# EAGLE schematic PCB_Outline (EAGLE 6.5.0)
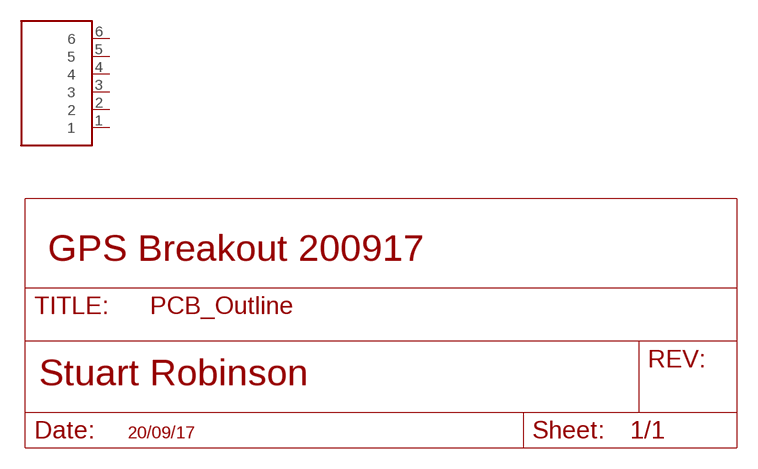
[diagram p0: schematic, sheet 1]

## Parts
CON1  6X1  [6X1]
Unconnected: CON1.1 CON1.2 CON1.3 CON1.4 CON1.5 CON1.6

## Notes on the sheet
- GPS Breakout 200917
- 20/09/17

## Library data of the parts
CON1 = My_Pin_Headers:6X1

## Net classes
0 default: width 0.152 mm
1 GND: width 0.508 mm
2 gpsdefault: width 0.508 mm
3 gpspower: width 0.508 mm